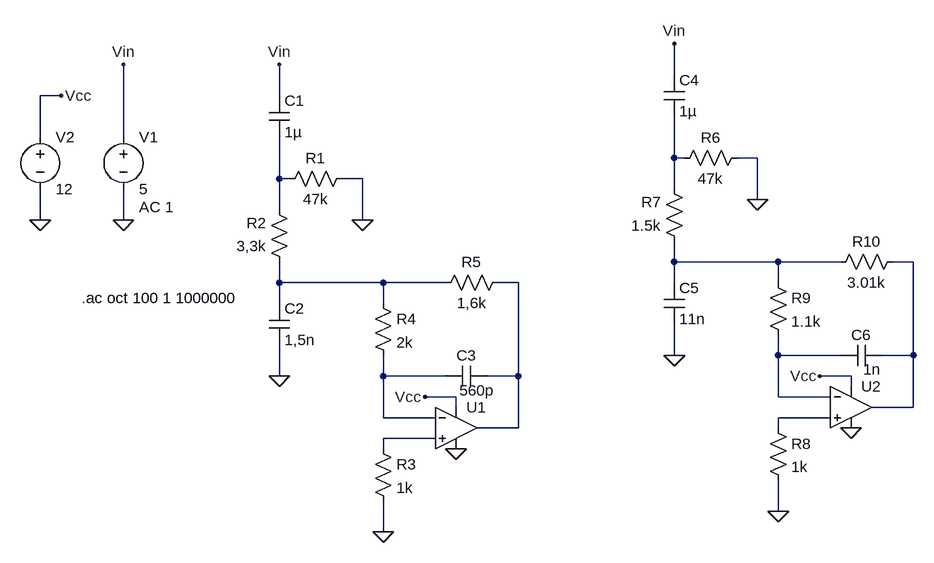
[diagram p0: schematic codec_in_filter.asc]
codec_in_filter.asc, the LTspice schematic file:
Version 4
SHEET 1 1288 692
WIRE 912 -32 912 -80
WIRE -32 0 -64 0
WIRE 304 0 304 -48
WIRE -64 64 -64 0
WIRE 64 64 64 -48
WIRE 912 96 912 32
WIRE 928 96 912 96
WIRE 1040 96 1008 96
WIRE 304 128 304 64
WIRE 320 128 304 128
WIRE 432 128 400 128
WIRE 912 144 912 96
WIRE 1040 160 1040 96
WIRE 304 176 304 128
WIRE -64 192 -64 144
WIRE 64 192 64 144
WIRE 432 192 432 128
WIRE 912 256 912 224
WIRE 1072 256 912 256
WIRE 1168 256 1072 256
WIRE 1280 256 1248 256
WIRE 304 288 304 256
WIRE 464 288 304 288
WIRE 560 288 464 288
WIRE 672 288 640 288
WIRE 912 288 912 256
WIRE 1072 288 1072 256
WIRE 304 320 304 288
WIRE 464 320 464 288
WIRE 912 400 912 352
WIRE 1072 400 1072 368
WIRE 1168 400 1072 400
WIRE 1280 400 1280 256
WIRE 1280 400 1232 400
WIRE 304 432 304 384
WIRE 464 432 464 400
WIRE 560 432 464 432
WIRE 672 432 672 288
WIRE 672 432 624 432
WIRE 1184 432 1136 432
WIRE 1184 448 1184 432
WIRE 576 464 528 464
WIRE 1072 464 1072 400
WIRE 1152 464 1072 464
WIRE 576 480 576 464
WIRE 1280 480 1280 400
WIRE 1280 480 1216 480
WIRE 464 496 464 432
WIRE 544 496 464 496
WIRE 1152 496 1072 496
WIRE 672 512 672 432
WIRE 672 512 608 512
WIRE 1072 512 1072 496
WIRE 544 528 464 528
WIRE 464 544 464 528
WIRE 1072 640 1072 592
WIRE 464 672 464 624
FLAG 304 432 0
FLAG 432 192 0
FLAG 64 192 0
FLAG 464 672 0
FLAG 64 -48 Vin
FLAG 528 464 Vcc
FLAG 576 544 0
FLAG 304 -48 Vin
FLAG -64 192 0
FLAG -32 0 Vcc
FLAG 912 400 0
FLAG 1040 160 0
FLAG 1072 640 0
FLAG 1136 432 Vcc
FLAG 1184 512 0
FLAG 912 -80 Vin
SYMBOL voltage 64 48 R0
WINDOW 123 24 124 Left 2
WINDOW 39 0 0 Left 0
SYMATTR Value2 AC 1
SYMATTR InstName V1
SYMATTR Value 5
SYMBOL cap 288 0 R0
SYMATTR InstName C1
SYMATTR Value 1µ
SYMBOL res 416 112 R90
WINDOW 0 0 56 VBottom 2
WINDOW 3 32 56 VTop 2
SYMATTR InstName R1
SYMATTR Value 47k
SYMBOL res 320 272 R180
WINDOW 0 36 76 Left 2
WINDOW 3 36 40 Left 2
SYMATTR InstName R2
SYMATTR Value 3,3k
SYMBOL cap 288 320 R0
SYMATTR InstName C2
SYMATTR Value 1,5n
SYMBOL res 448 528 R0
SYMATTR InstName R3
SYMATTR Value 1k
SYMBOL res 448 304 R0
SYMATTR InstName R4
SYMATTR Value 2k
SYMBOL res 656 272 R90
WINDOW 0 0 56 VBottom 2
WINDOW 3 32 56 VTop 2
SYMATTR InstName R5
SYMATTR Value 1,6k
SYMBOL cap 624 416 R90
WINDOW 0 0 32 VBottom 2
WINDOW 3 22 16 VTop 2
SYMATTR InstName C3
SYMATTR Value 560p
SYMBOL OpAmps\\UniversalOpAmp1 576 512 R0
SYMATTR InstName U1
SYMBOL voltage -64 48 R0
WINDOW 123 0 0 Left 0
WINDOW 39 0 0 Left 0
SYMATTR InstName V2
SYMATTR Value 12
SYMBOL cap 896 -32 R0
SYMATTR InstName C4
SYMATTR Value 1µ
SYMBOL res 1024 80 R90
WINDOW 0 0 56 VBottom 2
WINDOW 3 32 56 VTop 2
SYMATTR InstName R6
SYMATTR Value 47k
SYMBOL res 928 240 R180
WINDOW 0 36 76 Left 2
WINDOW 3 36 40 Left 2
SYMATTR InstName R7
SYMATTR Value 1.5k
SYMBOL cap 896 288 R0
SYMATTR InstName C5
SYMATTR Value 11n
SYMBOL res 1056 496 R0
SYMATTR InstName R8
SYMATTR Value 1k
SYMBOL res 1056 272 R0
SYMATTR InstName R9
SYMATTR Value 1.1k
SYMBOL res 1264 240 R90
WINDOW 0 0 56 VBottom 2
WINDOW 3 32 56 VTop 2
SYMATTR InstName R10
SYMATTR Value 3.01k
SYMBOL cap 1232 384 R90
WINDOW 0 0 32 VBottom 2
WINDOW 3 22 16 VTop 2
SYMATTR InstName C6
SYMATTR Value 1n
SYMBOL OpAmps\\UniversalOpAmp1 1184 480 R0
SYMATTR InstName U2
TEXT 0 312 Left 2 !.ac oct 100 1 1000000

The netlist it stands for:
* codec_in_filter.asc
V1 Vin 0 5 AC 1
C1 Vin N002 1µ
R1 0 N002 47k
R2 N005 N002 3,3k
C2 N005 0 1,5n
R3 N010 0 1k
R4 N005 N008 2k
R5 N006 N005 1,6k
C3 N006 N008 560p
XU1 N010 N008 Vcc 0 N006 level1 Avol=1Meg GBW=10Meg Vos=0 En=0 Enk=0 In=0 Ink=0 Rin=500Meg  ; pins In+ In- V+ V- OUT
V2 Vcc 0 12
C4 Vin N001 1µ
R6 0 N001 47k
R7 N003 N001 1.5k
C5 N003 0 11n
R8 N009 0 1k
R9 N003 N007 1.1k
R10 N004 N003 3.01k
C6 N004 N007 1n
XU2 N009 N007 Vcc 0 N004 level1 Avol=1Meg GBW=10Meg Vos=0 En=0 Enk=0 In=0 Ink=0 Rin=500Meg  ; pins In+ In- V+ V- OUT
.ac oct 100 1 1000000
.lib UniversalOpAmp1.lib
.backanno
.end